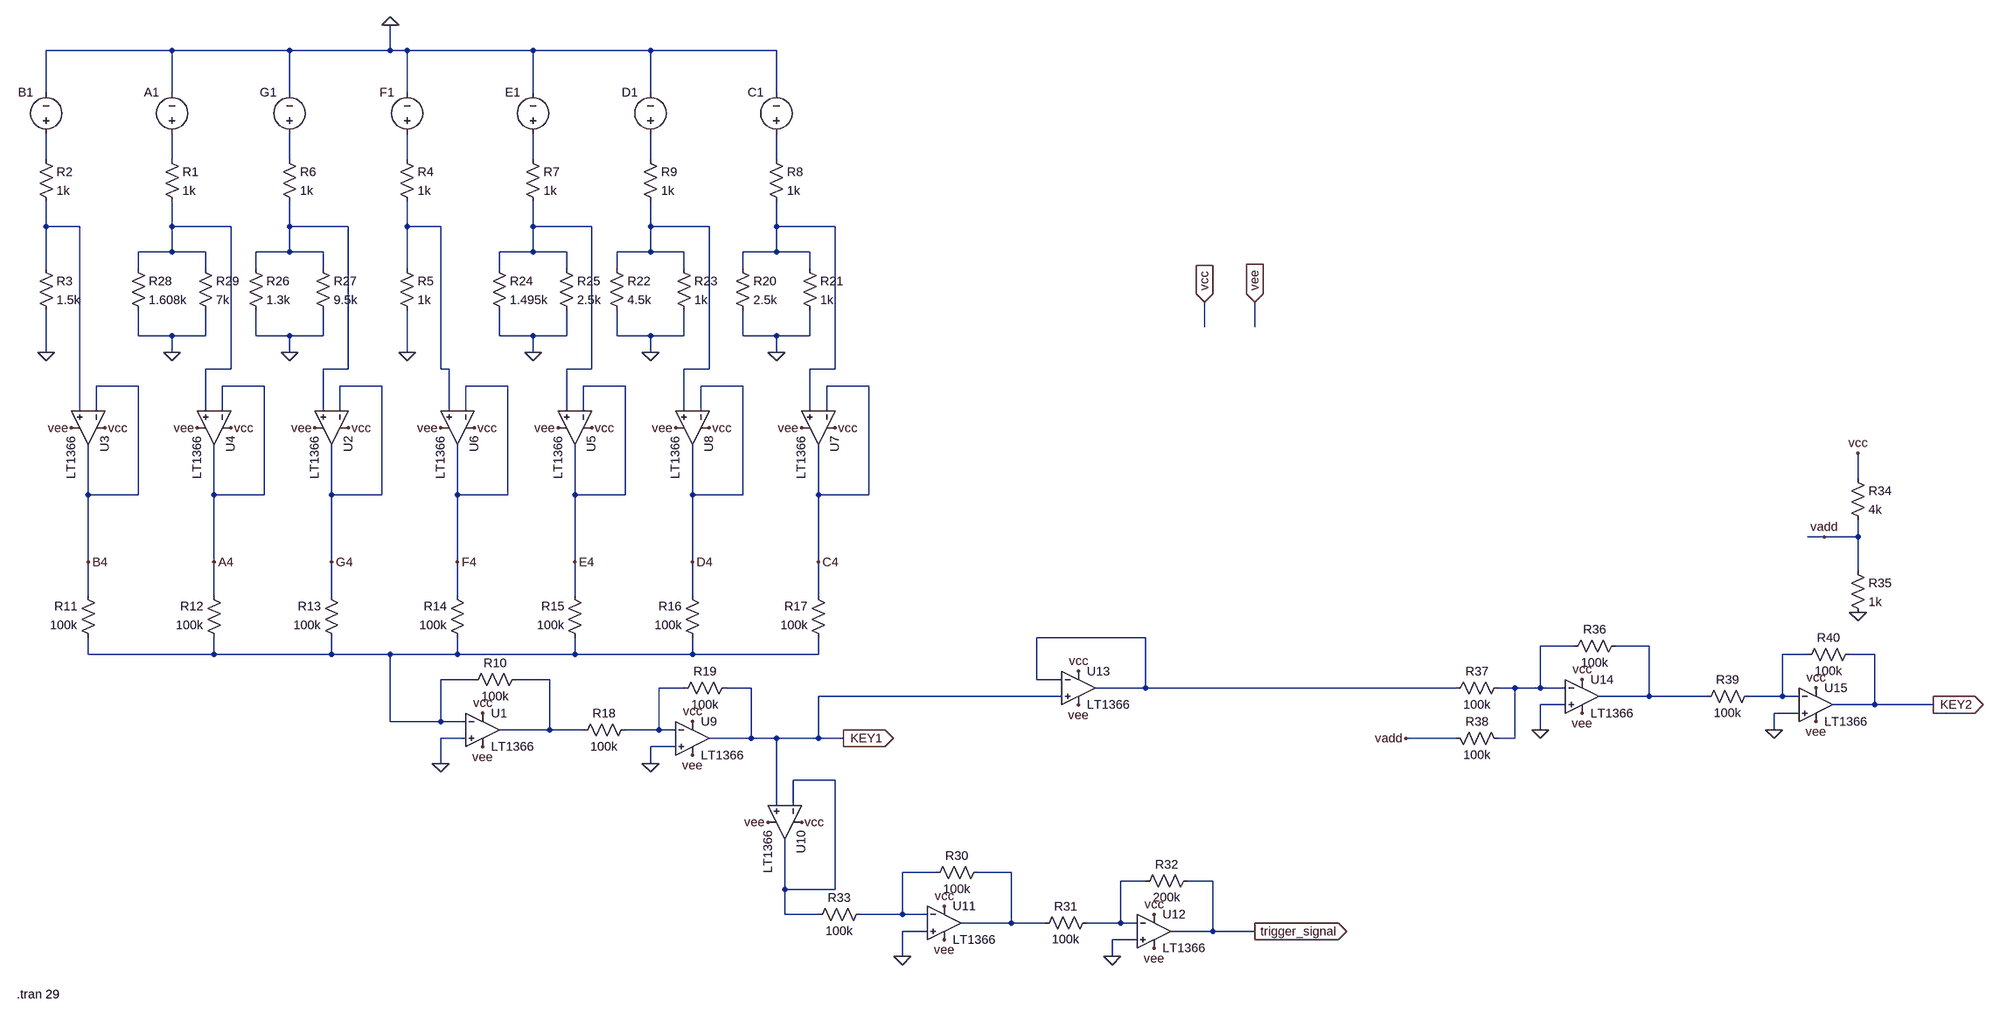
[diagram p0: schematic 3.6second_keyboard_hopefully_final.asc]
3.6second_keyboard_hopefully_final.asc, the LTspice schematic file:
Version 4
SHEET 1 2644 1832
WIRE -2704 -576 -2944 -576
WIRE -2480 -576 -2704 -576
WIRE -2288 -576 -2288 -624
WIRE -2288 -576 -2480 -576
WIRE -2256 -576 -2288 -576
WIRE -2016 -576 -2256 -576
WIRE -1792 -576 -2016 -576
WIRE -1552 -576 -1792 -576
WIRE -2944 -496 -2944 -576
WIRE -2704 -496 -2704 -576
WIRE -2480 -496 -2480 -576
WIRE -2256 -496 -2256 -576
WIRE -2016 -496 -2016 -576
WIRE -1792 -496 -1792 -576
WIRE -1552 -496 -1552 -576
WIRE -2944 -368 -2944 -416
WIRE -2704 -368 -2704 -416
WIRE -2480 -368 -2480 -416
WIRE -2256 -368 -2256 -416
WIRE -2016 -368 -2016 -416
WIRE -1792 -368 -1792 -416
WIRE -1552 -368 -1552 -416
WIRE -2944 -240 -2944 -288
WIRE -2880 -240 -2944 -240
WIRE -2704 -240 -2704 -288
WIRE -2592 -240 -2704 -240
WIRE -2480 -240 -2480 -288
WIRE -2368 -240 -2480 -240
WIRE -2256 -240 -2256 -288
WIRE -2192 -240 -2256 -240
WIRE -2016 -240 -2016 -288
WIRE -1904 -240 -2016 -240
WIRE -1792 -240 -1792 -288
WIRE -1680 -240 -1792 -240
WIRE -1552 -240 -1552 -288
WIRE -1440 -240 -1552 -240
WIRE -2704 -192 -2704 -240
WIRE -2704 -192 -2768 -192
WIRE -2640 -192 -2704 -192
WIRE -2480 -192 -2480 -240
WIRE -2480 -192 -2544 -192
WIRE -2416 -192 -2480 -192
WIRE -2016 -192 -2016 -240
WIRE -2016 -192 -2080 -192
WIRE -1952 -192 -2016 -192
WIRE -1792 -192 -1792 -240
WIRE -1792 -192 -1856 -192
WIRE -1728 -192 -1792 -192
WIRE -1552 -192 -1552 -240
WIRE -1552 -192 -1616 -192
WIRE -1488 -192 -1552 -192
WIRE -2944 -160 -2944 -240
WIRE -2768 -160 -2768 -192
WIRE -2640 -160 -2640 -192
WIRE -2544 -160 -2544 -192
WIRE -2416 -160 -2416 -192
WIRE -2256 -160 -2256 -240
WIRE -2080 -160 -2080 -192
WIRE -1952 -160 -1952 -192
WIRE -1856 -160 -1856 -192
WIRE -1728 -160 -1728 -192
WIRE -1616 -160 -1616 -192
WIRE -1488 -160 -1488 -192
WIRE -736 -48 -736 -96
WIRE -640 -48 -640 -96
WIRE -2768 -32 -2768 -80
WIRE -2704 -32 -2768 -32
WIRE -2640 -32 -2640 -80
WIRE -2640 -32 -2704 -32
WIRE -2544 -32 -2544 -80
WIRE -2480 -32 -2544 -32
WIRE -2416 -32 -2416 -80
WIRE -2416 -32 -2480 -32
WIRE -2080 -32 -2080 -80
WIRE -2016 -32 -2080 -32
WIRE -1952 -32 -1952 -80
WIRE -1952 -32 -2016 -32
WIRE -1856 -32 -1856 -80
WIRE -1792 -32 -1856 -32
WIRE -1728 -32 -1728 -80
WIRE -1728 -32 -1792 -32
WIRE -1616 -32 -1616 -80
WIRE -1552 -32 -1616 -32
WIRE -1488 -32 -1488 -80
WIRE -1488 -32 -1552 -32
WIRE -2944 0 -2944 -80
WIRE -2704 0 -2704 -32
WIRE -2480 0 -2480 -32
WIRE -2256 0 -2256 -80
WIRE -2016 0 -2016 -32
WIRE -1792 0 -1792 -32
WIRE -1552 0 -1552 -32
WIRE -2592 32 -2592 -240
WIRE -2592 32 -2640 32
WIRE -2368 32 -2368 -240
WIRE -2368 32 -2416 32
WIRE -2192 32 -2192 -240
WIRE -2176 32 -2192 32
WIRE -1904 32 -1904 -240
WIRE -1904 32 -1952 32
WIRE -1680 32 -1680 -240
WIRE -1680 32 -1728 32
WIRE -1440 32 -1440 -240
WIRE -1440 32 -1488 32
WIRE -2768 64 -2848 64
WIRE -2528 64 -2608 64
WIRE -2304 64 -2384 64
WIRE -2064 64 -2144 64
WIRE -1840 64 -1920 64
WIRE -1616 64 -1696 64
WIRE -1376 64 -1456 64
WIRE -2880 112 -2880 -240
WIRE -2848 112 -2848 64
WIRE -2640 112 -2640 32
WIRE -2608 112 -2608 64
WIRE -2416 112 -2416 32
WIRE -2384 112 -2384 64
WIRE -2176 112 -2176 32
WIRE -2144 112 -2144 64
WIRE -1952 112 -1952 32
WIRE -1920 112 -1920 64
WIRE -1728 112 -1728 32
WIRE -1696 112 -1696 64
WIRE -1488 112 -1488 32
WIRE -1456 112 -1456 64
WIRE 528 240 528 192
WIRE -2864 272 -2864 176
WIRE -2768 272 -2768 64
WIRE -2768 272 -2864 272
WIRE -2624 272 -2624 176
WIRE -2528 272 -2528 64
WIRE -2528 272 -2624 272
WIRE -2400 272 -2400 176
WIRE -2304 272 -2304 64
WIRE -2304 272 -2400 272
WIRE -2160 272 -2160 176
WIRE -2064 272 -2064 64
WIRE -2064 272 -2160 272
WIRE -1936 272 -1936 176
WIRE -1840 272 -1840 64
WIRE -1840 272 -1936 272
WIRE -1712 272 -1712 176
WIRE -1616 272 -1616 64
WIRE -1616 272 -1712 272
WIRE -1472 272 -1472 176
WIRE -1376 272 -1376 64
WIRE -1376 272 -1472 272
WIRE 464 352 432 352
WIRE 528 352 528 320
WIRE 528 352 464 352
WIRE -2864 400 -2864 272
WIRE -2624 400 -2624 272
WIRE -2400 400 -2400 272
WIRE -2160 400 -2160 272
WIRE -1936 400 -1936 272
WIRE -1712 400 -1712 272
WIRE -1472 400 -1472 272
WIRE 528 416 528 352
WIRE -2864 464 -2864 400
WIRE -2624 464 -2624 400
WIRE -2400 464 -2400 400
WIRE -2160 464 -2160 400
WIRE -1936 464 -1936 400
WIRE -1712 464 -1712 400
WIRE -1472 464 -1472 400
WIRE -848 544 -1056 544
WIRE -32 560 -96 560
WIRE 112 560 48 560
WIRE -2864 576 -2864 544
WIRE -2624 576 -2624 544
WIRE -2624 576 -2864 576
WIRE -2400 576 -2400 544
WIRE -2400 576 -2624 576
WIRE -2288 576 -2400 576
WIRE -2160 576 -2160 544
WIRE -2160 576 -2288 576
WIRE -1936 576 -1936 544
WIRE -1936 576 -2160 576
WIRE -1712 576 -1712 544
WIRE -1712 576 -1936 576
WIRE -1472 576 -1472 544
WIRE -1472 576 -1712 576
WIRE 432 576 384 576
WIRE 560 576 512 576
WIRE -2128 624 -2192 624
WIRE -1984 624 -2048 624
WIRE -1056 624 -1056 544
WIRE -1008 624 -1056 624
WIRE -1728 640 -1776 640
WIRE -1600 640 -1648 640
WIRE -848 640 -848 544
WIRE -848 640 -944 640
WIRE -256 640 -848 640
WIRE -144 640 -176 640
WIRE -96 640 -96 560
WIRE -96 640 -144 640
WIRE -48 640 -96 640
WIRE -1008 656 -1472 656
WIRE 112 656 112 560
WIRE 112 656 16 656
WIRE 240 656 112 656
WIRE 384 656 384 576
WIRE 384 656 320 656
WIRE 416 656 384 656
WIRE -48 672 -96 672
WIRE 560 672 560 576
WIRE 560 672 480 672
WIRE 672 672 560 672
WIRE 416 688 368 688
WIRE -2288 704 -2288 576
WIRE -2192 704 -2192 624
WIRE -2192 704 -2288 704
WIRE -2144 704 -2192 704
WIRE -1984 720 -1984 624
WIRE -1984 720 -2080 720
WIRE -1920 720 -1984 720
WIRE -1776 720 -1776 640
WIRE -1776 720 -1840 720
WIRE -1744 720 -1776 720
WIRE -96 720 -96 672
WIRE 368 720 368 688
WIRE -2144 736 -2192 736
WIRE -1600 736 -1600 640
WIRE -1600 736 -1680 736
WIRE -1552 736 -1600 736
WIRE -1472 736 -1472 656
WIRE -1472 736 -1552 736
WIRE -1424 736 -1472 736
WIRE -256 736 -352 736
WIRE -144 736 -144 640
WIRE -144 736 -176 736
WIRE -1744 752 -1792 752
WIRE -2192 784 -2192 736
WIRE -1792 784 -1792 752
WIRE -1440 816 -1520 816
WIRE -1552 864 -1552 736
WIRE -1520 864 -1520 816
WIRE -1248 992 -1312 992
WIRE -1104 992 -1168 992
WIRE -848 1008 -896 1008
WIRE -720 1008 -768 1008
WIRE -1536 1024 -1536 928
WIRE -1440 1024 -1440 816
WIRE -1440 1024 -1536 1024
WIRE -1536 1072 -1536 1024
WIRE -1472 1072 -1536 1072
WIRE -1312 1072 -1312 992
WIRE -1312 1072 -1392 1072
WIRE -1264 1072 -1312 1072
WIRE -1104 1088 -1104 992
WIRE -1104 1088 -1200 1088
WIRE -1040 1088 -1104 1088
WIRE -896 1088 -896 1008
WIRE -896 1088 -960 1088
WIRE -864 1088 -896 1088
WIRE -1264 1104 -1312 1104
WIRE -720 1104 -720 1008
WIRE -720 1104 -800 1104
WIRE -640 1104 -720 1104
WIRE -864 1120 -912 1120
WIRE -1312 1152 -1312 1104
WIRE -912 1152 -912 1120
FLAG -2288 -624 0
FLAG -1472 400 C4
FLAG -1712 400 D4
FLAG -1936 400 E4
FLAG -2160 400 F4
FLAG -2400 400 G4
FLAG -2624 400 A4
FLAG -2864 400 B4
FLAG -2192 784 0
FLAG -1440 144 vcc
FLAG -1680 144 vcc
FLAG -1904 144 vcc
FLAG -1504 144 vee
FLAG -1744 144 vee
FLAG -1968 144 vee
FLAG -1792 784 0
FLAG -1424 736 KEY1
IOPIN -1424 736 Out
FLAG -1552 0 0
FLAG -1792 0 0
FLAG -2016 0 0
FLAG -2480 0 0
FLAG -2704 0 0
FLAG -2944 0 0
FLAG -2256 0 0
FLAG -640 1104 trigger_signal
IOPIN -640 1104 Out
FLAG -1312 1152 0
FLAG -912 1152 0
FLAG 528 496 0
FLAG 528 192 vcc
FLAG -96 720 0
FLAG 464 352 vadd
FLAG -352 736 vadd
FLAG 368 720 0
FLAG 672 672 KEY2
IOPIN 672 672 Out
FLAG -2128 144 vcc
FLAG -2368 144 vcc
FLAG -1712 704 vcc
FLAG -2112 688 vcc
FLAG -976 608 vcc
FLAG -16 624 vcc
FLAG -832 1072 vcc
FLAG -1232 1056 vcc
FLAG -1504 896 vcc
FLAG -2592 144 vcc
FLAG -2832 144 vcc
FLAG -2192 144 vee
FLAG -2432 144 vee
FLAG -2656 144 vee
FLAG -2896 144 vee
FLAG -2112 752 vee
FLAG -1712 768 vee
FLAG -1568 896 vee
FLAG -1232 1120 vee
FLAG -832 1136 vee
FLAG -976 672 vee
FLAG -16 688 vee
FLAG 448 704 vee
FLAG 448 640 vcc
FLAG -736 -96 vcc
IOPIN -736 -96 In
FLAG -640 -96 vee
IOPIN -640 -96 In
SYMBOL res -2720 -384 R0
SYMATTR InstName R1
SYMATTR Value 1k
SYMBOL res -2960 -384 R0
SYMATTR InstName R2
SYMATTR Value 1k
SYMBOL res -2960 -176 R0
SYMATTR InstName R3
SYMATTR Value 1.5k
SYMBOL res -2272 -384 R0
SYMATTR InstName R4
SYMATTR Value 1k
SYMBOL res -2272 -176 R0
SYMATTR InstName R5
SYMATTR Value 1k
SYMBOL res -2496 -384 R0
SYMATTR InstName R6
SYMATTR Value 1k
SYMBOL res -2032 -384 R0
SYMATTR InstName R7
SYMATTR Value 1k
SYMBOL res -1568 -384 R0
SYMATTR InstName R8
SYMATTR Value 1k
SYMBOL res -1808 -384 R0
SYMATTR InstName R9
SYMATTR Value 1k
SYMBOL voltage -2944 -400 R180
WINDOW 0 24 96 Left 2
WINDOW 3 24 16 Invisible 2
WINDOW 123 0 0 Left 0
WINDOW 39 0 0 Left 0
SYMATTR InstName B1
SYMATTR Value PWL(24.55 0 24.550000000001 5 28.15 5 28.150000000001 0)
SYMBOL voltage -2704 -400 R180
WINDOW 0 24 96 Left 2
WINDOW 3 24 16 Invisible 2
WINDOW 123 0 0 Left 0
WINDOW 39 0 0 Left 0
SYMATTR InstName A1
SYMATTR Value PWL(20.45 0 20.450000000001 5 24.05 5 24.050000000001 0)
SYMBOL voltage -2480 -400 R180
WINDOW 0 24 96 Left 2
WINDOW 3 24 68 Invisible 2
WINDOW 123 0 0 Left 0
WINDOW 39 0 0 Left 0
SYMATTR InstName G1
SYMATTR Value PWL(16.35 0 16.350000000001 5 19.95 5 19.950000000001 0)
SYMBOL voltage -2256 -400 R180
WINDOW 0 24 96 Left 2
WINDOW 3 24 68 Invisible 2
WINDOW 123 0 0 Left 0
WINDOW 39 0 0 Left 0
SYMATTR InstName F1
SYMATTR Value PWL(12.25 0 12.250000000001 5 15.85 5 15.850000000001 0)
SYMBOL voltage -2016 -400 R180
WINDOW 0 24 96 Left 2
WINDOW 3 24 68 Invisible 2
WINDOW 123 0 0 Left 0
WINDOW 39 0 0 Left 0
SYMATTR InstName E1
SYMATTR Value PWL(8.15 0 8.150000000001 5 11.75 5 11.750000000001 0)
SYMBOL voltage -1792 -400 R180
WINDOW 0 24 96 Left 2
WINDOW 3 24 68 Invisible 2
WINDOW 123 0 0 Left 0
WINDOW 39 0 0 Left 0
SYMATTR InstName D1
SYMATTR Value PWL(4.05 0 4.050000000001 5 7.65 5 7.650000000001 0)
SYMBOL voltage -1552 -400 R180
WINDOW 0 24 96 Left 2
WINDOW 3 24 68 Invisible 2
WINDOW 123 0 0 Left 0
WINDOW 39 0 0 Left 0
SYMATTR InstName C1
SYMATTR Value PWL(0 0 0.049999999999 0 0.05 5 3.65 5 3.650000000001 0)
SYMBOL Opamps\\LT1366 -2112 656 R0
SYMATTR InstName U1
SYMBOL res -2032 608 R90
WINDOW 0 0 56 VBottom 2
WINDOW 3 32 56 VTop 2
SYMATTR InstName R10
SYMATTR Value 100k
SYMBOL res -2848 560 R180
WINDOW 0 36 76 Left 2
WINDOW 3 36 40 Left 2
SYMATTR InstName R11
SYMATTR Value 100k
SYMBOL res -2608 560 R180
WINDOW 0 36 76 Left 2
WINDOW 3 36 40 Left 2
SYMATTR InstName R12
SYMATTR Value 100k
SYMBOL res -2384 560 R180
WINDOW 0 36 76 Left 2
WINDOW 3 36 40 Left 2
SYMATTR InstName R13
SYMATTR Value 100k
SYMBOL res -2144 560 R180
WINDOW 0 36 76 Left 2
WINDOW 3 36 40 Left 2
SYMATTR InstName R14
SYMATTR Value 100k
SYMBOL res -1920 560 R180
WINDOW 0 36 76 Left 2
WINDOW 3 36 40 Left 2
SYMATTR InstName R15
SYMATTR Value 100k
SYMBOL res -1696 560 R180
WINDOW 0 36 76 Left 2
WINDOW 3 36 40 Left 2
SYMATTR InstName R16
SYMATTR Value 100k
SYMBOL res -1456 560 R180
WINDOW 0 36 76 Left 2
WINDOW 3 36 40 Left 2
SYMATTR InstName R17
SYMATTR Value 100k
SYMBOL Opamps\\LT1366 -2336 144 R90
SYMATTR InstName U2
SYMBOL Opamps\\LT1366 -2800 144 R90
SYMATTR InstName U3
SYMBOL Opamps\\LT1366 -2560 144 R90
SYMATTR InstName U4
SYMBOL Opamps\\LT1366 -1872 144 R90
SYMATTR InstName U5
SYMBOL Opamps\\LT1366 -2096 144 R90
SYMATTR InstName U6
SYMBOL Opamps\\LT1366 -1408 144 R90
SYMATTR InstName U7
SYMBOL Opamps\\LT1366 -1648 144 R90
SYMATTR InstName U8
SYMBOL Opamps\\LT1366 -1712 672 R0
SYMATTR InstName U9
SYMBOL res -1824 704 R90
WINDOW 0 0 56 VBottom 2
WINDOW 3 32 56 VTop 2
SYMATTR InstName R18
SYMATTR Value 100k
SYMBOL res -1632 624 R90
WINDOW 0 0 56 VBottom 2
WINDOW 3 32 56 VTop 2
SYMATTR InstName R19
SYMATTR Value 100k
SYMBOL res -1632 -176 R0
SYMATTR InstName R20
SYMATTR Value 2.5k
SYMBOL res -1504 -176 R0
SYMATTR InstName R21
SYMATTR Value 1k
SYMBOL res -1872 -176 R0
SYMATTR InstName R22
SYMATTR Value 4.5k
SYMBOL res -1744 -176 R0
SYMATTR InstName R23
SYMATTR Value 1k
SYMBOL res -2096 -176 R0
SYMATTR InstName R24
SYMATTR Value 1.495k
SYMBOL res -1968 -176 R0
SYMATTR InstName R25
SYMATTR Value 2.5k
SYMBOL res -2560 -176 R0
SYMATTR InstName R26
SYMATTR Value 1.3k
SYMBOL res -2432 -176 R0
SYMATTR InstName R27
SYMATTR Value 9.5k
SYMBOL res -2784 -176 R0
SYMATTR InstName R28
SYMATTR Value 1.608k
SYMBOL res -2656 -176 R0
SYMATTR InstName R29
SYMATTR Value 7k
SYMBOL Opamps\\LT1366 -1472 896 R90
SYMATTR InstName U10
SYMBOL Opamps\\LT1366 -1232 1024 R0
SYMATTR InstName U11
SYMBOL res -1152 976 R90
WINDOW 0 0 56 VBottom 2
WINDOW 3 32 56 VTop 2
SYMATTR InstName R30
SYMATTR Value 100k
SYMBOL Opamps\\LT1366 -832 1040 R0
SYMATTR InstName U12
SYMBOL res -944 1072 R90
WINDOW 0 0 56 VBottom 2
WINDOW 3 32 56 VTop 2
SYMATTR InstName R31
SYMATTR Value 100k
SYMBOL res -752 992 R90
WINDOW 0 0 56 VBottom 2
WINDOW 3 32 56 VTop 2
SYMATTR InstName R32
SYMATTR Value 200k
SYMBOL res -1376 1056 R90
WINDOW 0 0 56 VBottom 2
WINDOW 3 32 56 VTop 2
SYMATTR InstName R33
SYMATTR Value 100k
SYMBOL res 512 224 R0
SYMATTR InstName R34
SYMATTR Value 4k
SYMBOL Opamps\\LT1366 -976 576 R0
SYMATTR InstName U13
SYMBOL res 512 400 R0
SYMATTR InstName R35
SYMATTR Value 1k
SYMBOL Opamps\\LT1366 -16 592 R0
SYMATTR InstName U14
SYMBOL res 64 544 R90
WINDOW 0 0 56 VBottom 2
WINDOW 3 32 56 VTop 2
SYMATTR InstName R36
SYMATTR Value 100k
SYMBOL res -160 624 R90
WINDOW 0 0 56 VBottom 2
WINDOW 3 32 56 VTop 2
SYMATTR InstName R37
SYMATTR Value 100k
SYMBOL res -272 720 M90
WINDOW 0 0 56 VBottom 2
WINDOW 3 32 56 VTop 2
SYMATTR InstName R38
SYMATTR Value 100k
SYMBOL Opamps\\LT1366 448 608 R0
SYMATTR InstName U15
SYMBOL res 336 640 R90
WINDOW 0 0 56 VBottom 2
WINDOW 3 32 56 VTop 2
SYMATTR InstName R39
SYMATTR Value 100k
SYMBOL res 528 560 R90
WINDOW 0 0 56 VBottom 2
WINDOW 3 32 56 VTop 2
SYMATTR InstName R40
SYMATTR Value 100k
TEXT -3000 1224 Left 2 !.tran 29

The netlist it stands for:
* 3.6second_keyboard_hopefully_final.asc
R1 N002 N009 1k
R2 N001 N008 1k
R3 N008 0 1.5k
R4 N004 N011 1k
R5 N011 0 1k
R6 N003 N010 1k
R7 N005 N012 1k
R8 N007 N014 1k
R9 N006 N013 1k
V§B1 N001 0 PWL(24.55 0 24.550000000001 5 28.15 5 28.150000000001 0)
V§A1 N002 0 PWL(20.45 0 20.450000000001 5 24.05 5 24.050000000001 0)
V§G1 N003 0 PWL(16.35 0 16.350000000001 5 19.95 5 19.950000000001 0)
V§F1 N004 0 PWL(12.25 0 12.250000000001 5 15.85 5 15.850000000001 0)
V§E1 N005 0 PWL(8.15 0 8.150000000001 5 11.75 5 11.750000000001 0)
V§D1 N006 0 PWL(4.05 0 4.050000000001 5 7.65 5 7.650000000001 0)
V§C1 N007 0 PWL(0 0 0.049999999999 0 0.05 5 3.65 5 3.650000000001 0)
XU1 0 N018 vcc vee N020 LT1366  ; pins In+ In- V+ V- OUT
R10 N020 N018 100k
R11 N018 B4 100k
R12 N018 A4 100k
R13 N018 G4 100k
R14 N018 F4 100k
R15 N018 E4 100k
R16 N018 D4 100k
R17 N018 C4 100k
XU2 N010 G4 vcc vee G4 LT1366  ; pins In+ In- V+ V- OUT
XU3 N008 B4 vcc vee B4 LT1366  ; pins In+ In- V+ V- OUT
XU4 N009 A4 vcc vee A4 LT1366  ; pins In+ In- V+ V- OUT
XU5 N012 E4 vcc vee E4 LT1366  ; pins In+ In- V+ V- OUT
XU6 N011 F4 vcc vee F4 LT1366  ; pins In+ In- V+ V- OUT
XU7 N014 C4 vcc vee C4 LT1366  ; pins In+ In- V+ V- OUT
XU8 N013 D4 vcc vee D4 LT1366  ; pins In+ In- V+ V- OUT
XU9 0 N021 vcc vee KEY1 LT1366  ; pins In+ In- V+ V- OUT
R18 N021 N020 100k
R19 KEY1 N021 100k
R20 N014 0 2.5k
R21 N014 0 1k
R22 N013 0 4.5k
R23 N013 0 1k
R24 N012 0 1.495k
R25 N012 0 2.5k
R26 N010 0 1.3k
R27 N010 0 9.5k
R28 N009 0 1.608k
R29 N009 0 7k
XU10 KEY1 N022 vcc vee N022 LT1366  ; pins In+ In- V+ V- OUT
XU11 0 N023 vcc vee N024 LT1366  ; pins In+ In- V+ V- OUT
R30 N024 N023 100k
XU12 0 N025 vcc vee trigger_signal LT1366  ; pins In+ In- V+ V- OUT
R31 N025 N024 100k
R32 trigger_signal N025 200k
R33 N023 N022 100k
R34 vcc vadd 4k
XU13 KEY1 N015 vcc vee N015 LT1366  ; pins In+ In- V+ V- OUT
R35 vadd 0 1k
XU14 0 N016 vcc vee N017 LT1366  ; pins In+ In- V+ V- OUT
R36 N017 N016 100k
R37 N016 N015 100k
R38 vadd N016 100k
XU15 0 N019 vcc vee KEY2 LT1366  ; pins In+ In- V+ V- OUT
R39 N019 N017 100k
R40 KEY2 N019 100k
.tran 29
.lib LTC.lib
.backanno
.end